# EAGLE schematic Aquila_mobile (EAGLE 6.3)

## Sheet 1 of 5: 0-COVER
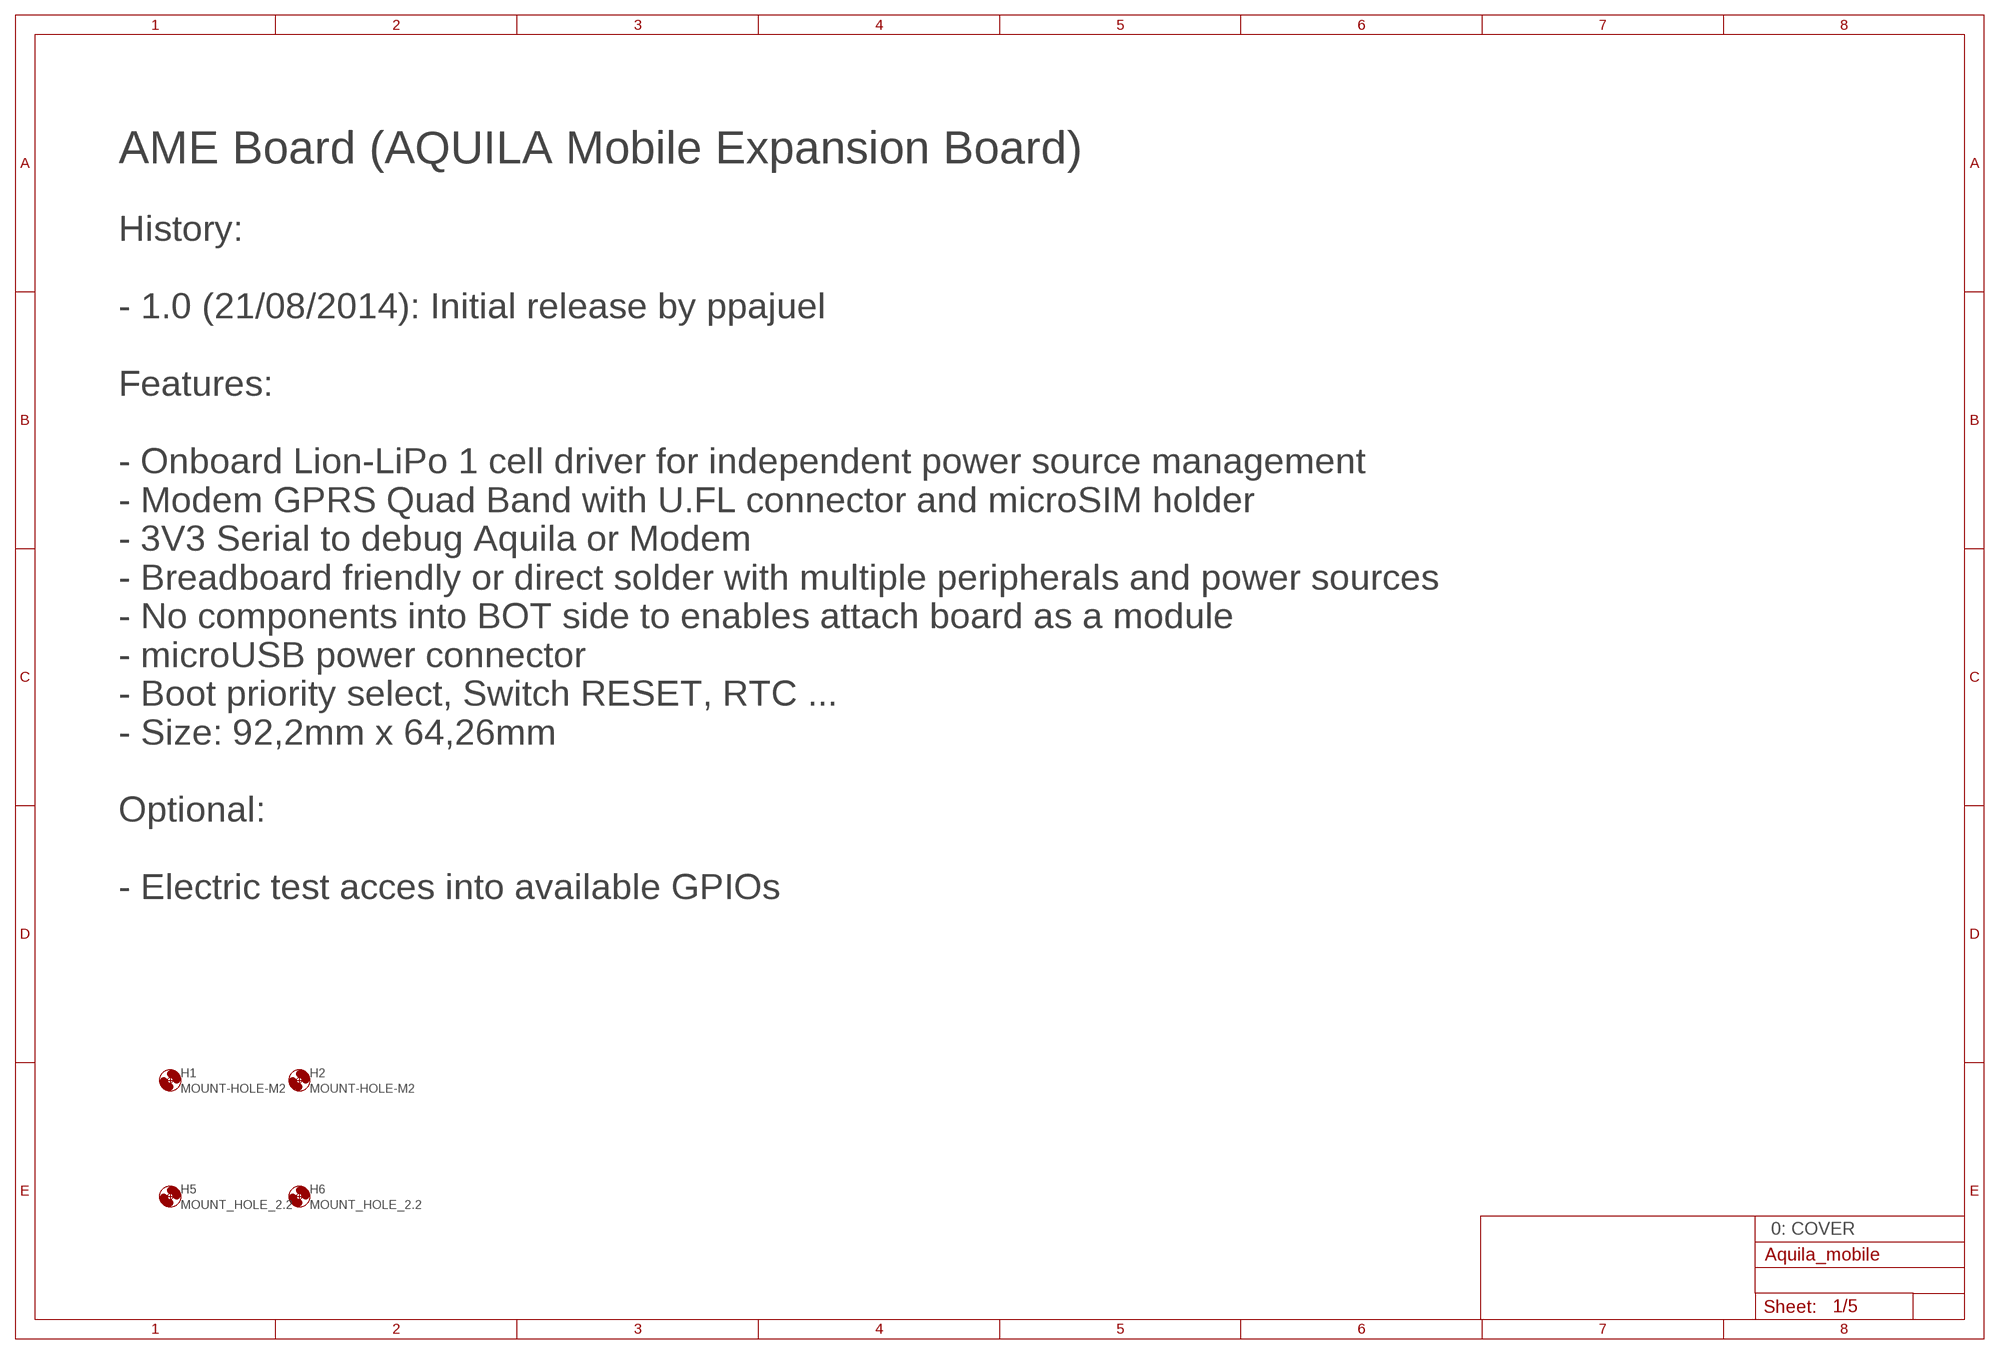
[diagram p0: schematic, sheet 1]

### Parts
H1  MOUNT-HOLE-M2  MOUNT-HOLE5.0  [5,0]
H2  MOUNT-HOLE-M2  MOUNT-HOLE5.0  [5,0]
H5  MOUNT_HOLE_2.2  [HOLE-2.2]
H6  MOUNT_HOLE_2.2  [HOLE-2.2]

### Notes on the sheet
- AME Board (AQUILA Mobile Expansion Board)
- History:
  
  - 1.0 (21/08/2014): Initial release by ppajuel
  
  Features:
  
  - Onboard Lion-LiPo 1 cell driver for independent power source management
  - Modem GPRS Quad Band with U.FL connector and microSIM holder
  - 3V3 Serial to debug Aquila or Modem
  - Breadboard friendly or direct solder with multiple peripherals and power sources
  - No components into BOT side to enables attach board as a module
  - microUSB power connector
  - Boot priority select, Switch RESET, RTC ...
  - Size: 92,2mm x 64,26mm
  
  Optional:
  
  - Electric test acces into available GPIOs
- 0: COVER

## Sheet 2 of 5: 1-SODIMM
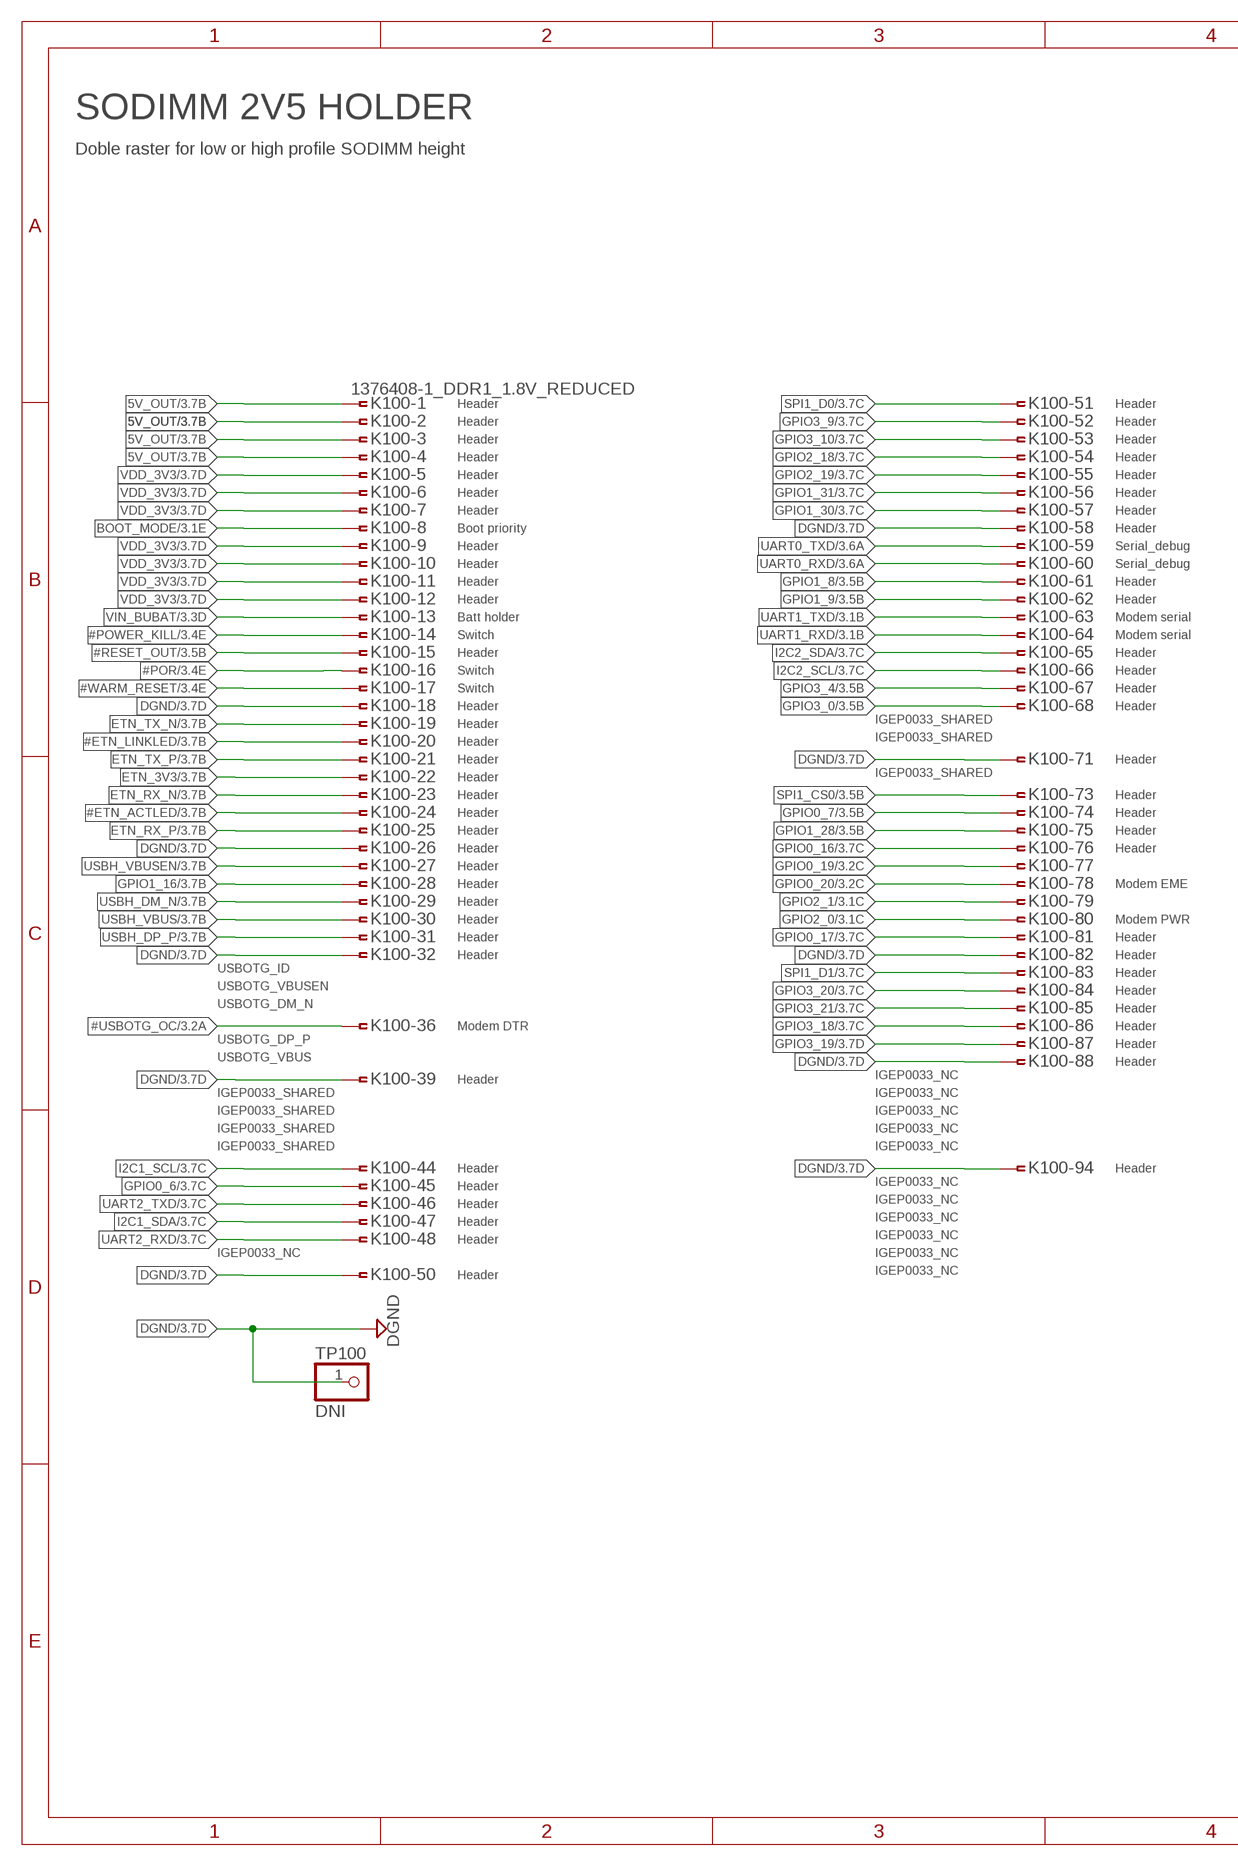
[diagram p1: schematic, sheet 2, part 1 of 2]
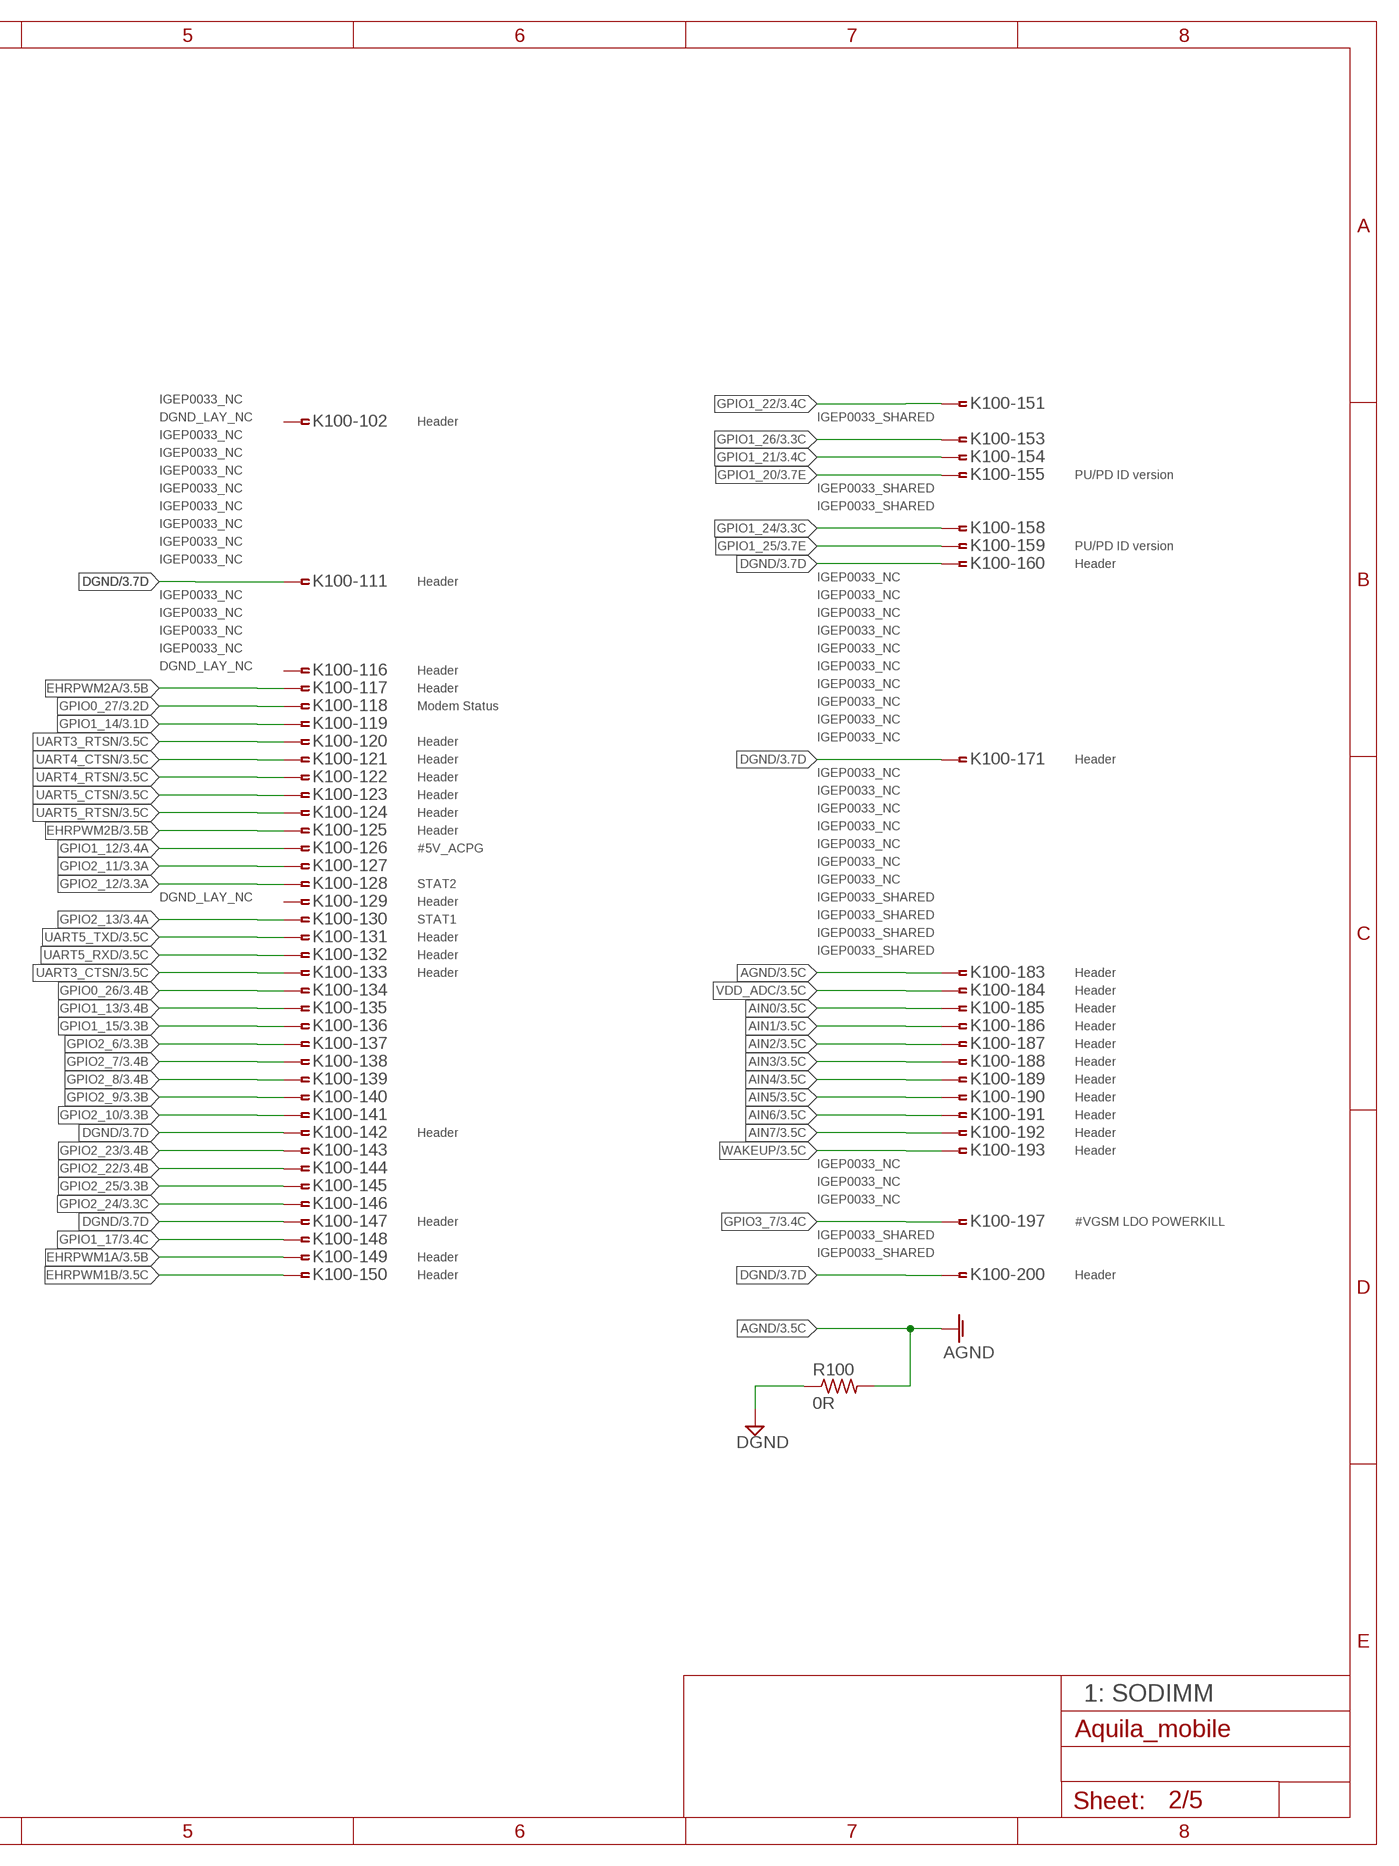
[diagram p2: schematic, sheet 2, part 2 of 2]

### Parts
K100  1376408-1_DDR1_1.8V_REDUCED  [1-1376408-1_REDUCED]
R100  0R  R-US_R0402  [R0402]
TP100  DNI  PINHD-1X1  [1X01]

### Nets
5V_OUT: K100.1 K100.2 K100.3 K100.4 ; also sheet 3,5
#ETN_ACTLED: K100.24 ; also sheet 3
#ETN_LINKLED: K100.20 ; also sheet 3
#POR: K100.16 ; also sheet 3
#POWER_KILL: K100.14 ; also sheet 3
#RESET_OUT: K100.15 ; also sheet 3
#USBOTG_OC: K100.36 ; also sheet 3,4
#WARM_RESET: K100.17 ; also sheet 3
AGND: K100.183 R100.2 ; also sheet 3
AIN0: K100.185 ; also sheet 3
AIN1: K100.186 ; also sheet 3
AIN2: K100.187 ; also sheet 3
AIN3: K100.188 ; also sheet 3
AIN4: K100.189 ; also sheet 3
AIN5: K100.190 ; also sheet 3
AIN6: K100.191 ; also sheet 3
AIN7: K100.192 ; also sheet 3
BOOT_MODE: K100.8 ; also sheet 3
DGND: K100.18 K100.26 K100.32 K100.39 K100.50 K100.58 K100.71 K100.82 K100.88 K100.94 K100.111 K100.142 K100.147 K100.160 K100.171 K100.200 R100.1 TP100.1 ; also sheet 3,4,5
EHRPWM1A: K100.149 ; also sheet 3
EHRPWM1B: K100.150 ; also sheet 3
EHRPWM2A: K100.117 ; also sheet 3
EHRPWM2B: K100.125 ; also sheet 3
ETN_3V3: K100.22 ; also sheet 3
ETN_RX_N: K100.23 ; also sheet 3
ETN_RX_P: K100.25 ; also sheet 3
ETN_TX_N: K100.19 ; also sheet 3
ETN_TX_P: K100.21 ; also sheet 3
GPIO0_6: K100.45 ; also sheet 3
GPIO0_7: K100.74 ; also sheet 3
GPIO0_16: K100.76 ; also sheet 3
GPIO0_17: K100.81 ; also sheet 3
GPIO0_19: K100.77 ; also sheet 3
GPIO0_20: K100.78 ; also sheet 3,4
GPIO0_26: K100.134 ; also sheet 3
GPIO0_27: K100.118 ; also sheet 3,4
GPIO1_8: K100.61 ; also sheet 3
GPIO1_9: K100.62 ; also sheet 3
GPIO1_12: K100.126 ; also sheet 3,5
GPIO1_13: K100.135 ; also sheet 3
GPIO1_14: K100.119 ; also sheet 3
GPIO1_15: K100.136 ; also sheet 3
GPIO1_16: K100.28 ; also sheet 3
GPIO1_17: K100.148 ; also sheet 3
GPIO1_20: K100.155 ; also sheet 3
GPIO1_21: K100.154 ; also sheet 3
GPIO1_22: K100.151 ; also sheet 3
GPIO1_24: K100.158 ; also sheet 3
GPIO1_25: K100.159 ; also sheet 3
GPIO1_26: K100.153 ; also sheet 3
GPIO1_28: K100.75 ; also sheet 3
GPIO1_30: K100.57 ; also sheet 3
GPIO1_31: K100.56 ; also sheet 3
GPIO2_0: K100.80 ; also sheet 3,4
GPIO2_1: K100.79 ; also sheet 3
GPIO2_6: K100.137 ; also sheet 3
GPIO2_7: K100.138 ; also sheet 3
GPIO2_8: K100.139 ; also sheet 3
GPIO2_9: K100.140 ; also sheet 3
GPIO2_10: K100.141 ; also sheet 3
GPIO2_11: K100.127 ; also sheet 3
GPIO2_12: K100.128 ; also sheet 3,5
GPIO2_13: K100.130 ; also sheet 3,5
GPIO2_18: K100.54 ; also sheet 3
GPIO2_19: K100.55 ; also sheet 3
GPIO2_22: K100.144 ; also sheet 3
GPIO2_23: K100.143 ; also sheet 3
GPIO2_24: K100.146 ; also sheet 3
GPIO2_25: K100.145 ; also sheet 3
GPIO3_0: K100.68 ; also sheet 3
GPIO3_4: K100.67 ; also sheet 3
GPIO3_7: K100.197 ; also sheet 3,5
GPIO3_9: K100.52 ; also sheet 3
GPIO3_10: K100.53 ; also sheet 3
GPIO3_18: K100.86 ; also sheet 3
GPIO3_19: K100.87 ; also sheet 3
GPIO3_20: K100.84 ; also sheet 3
GPIO3_21: K100.85 ; also sheet 3
I2C1_SCL: K100.44 ; also sheet 3
I2C1_SDA: K100.47 ; also sheet 3
I2C2_SCL: K100.66 ; also sheet 3
I2C2_SDA: K100.65 ; also sheet 3
SPI1_CS0: K100.73 ; also sheet 3
SPI1_D0: K100.51 ; also sheet 3
SPI1_D1: K100.83 ; also sheet 3
UART0_RXD: K100.60 ; also sheet 3
UART0_TXD: K100.59 ; also sheet 3
UART1_RXD: K100.64 ; also sheet 3,4
UART1_TXD: K100.63 ; also sheet 3,4
UART2_RXD: K100.48 ; also sheet 3
UART2_TXD: K100.46 ; also sheet 3
UART3_CTSN: K100.133 ; also sheet 3
UART3_RTSN: K100.120 ; also sheet 3
UART4_CTSN: K100.121 ; also sheet 3
UART4_RTSN: K100.122 ; also sheet 3
UART5_CTSN: K100.123 ; also sheet 3
UART5_RTSN: K100.124 ; also sheet 3
UART5_RXD: K100.132 ; also sheet 3
UART5_TXD: K100.131 ; also sheet 3
USBH_DM_N: K100.29 ; also sheet 3
USBH_DP_P: K100.31 ; also sheet 3
USBH_VBUS: K100.30 ; also sheet 3
USBH_VBUSEN: K100.27 ; also sheet 3
VDD_3V3: K100.5 K100.6 K100.7 K100.9 K100.10 K100.11 K100.12 ; also sheet 3,5
VDD_ADC: K100.184 ; also sheet 3
VIN_BUBAT: K100.13 ; also sheet 3
WAKEUP: K100.193 ; also sheet 3
Unconnected: K100.102 K100.116 K100.129

### Notes on the sheet
- SODIMM 2V5 HOLDER
- Doble raster for low or high profile SODIMM height
- IGEP0033_NC
- Header | Header
- DGND_LAY_NC | IGEP0033_SHARED
- Header | Header | Header
- IGEP0033_NC
- Header | Header
- IGEP0033_NC
- Header | Header
- IGEP0033_NC
- Header | Header | PU/PD ID version
- IGEP0033_NC | IGEP0033_SHARED
- Header | Header
- IGEP0033_NC | IGEP0033_SHARED
- Header | Header
- IGEP0033_NC
- Boot priority | Header
- IGEP0033_NC
- Header | Serial_debug | PU/PD ID version
- IGEP0033_NC
- Header | Serial_debug | Header
- IGEP0033_NC
- Header | Header | Header
- IGEP0033_NC | IGEP0033_NC
- Header | Header
- IGEP0033_NC | IGEP0033_NC
- Batt holder | Modem serial
- IGEP0033_NC | IGEP0033_NC
- Switch | Modem serial
- IGEP0033_NC | IGEP0033_NC
- Header | Header
- DGND_LAY_NC | IGEP0033_NC
- Switch | Header | Header
- IGEP0033_NC
- Switch | Header | Header
- IGEP0033_NC
- Header | Header | Modem Status
- IGEP0033_SHARED | IGEP0033_NC
- Header
- IGEP0033_SHARED | IGEP0033_NC
- Header | Header
- Header | Header | Header | Header
- IGEP0033_SHARED | IGEP0033_NC
- Header | Header
- IGEP0033_NC
- Header | Header | Header
- IGEP0033_NC
- Header | Header | Header
- IGEP0033_NC
- Header | Header | Header
- IGEP0033_NC
- Header | Header | #5V_ACPG
- IGEP0033_NC
- Header
- IGEP0033_NC
- Header | Modem EME | STAT2
- DGND_LAY_NC | IGEP0033_SHARED
- Header | Header
- IGEP0033_SHARED
- Header | Modem PWR | STAT1
- IGEP0033_SHARED
- Header | Header | Header
- IGEP0033_SHARED
- Header | Header | Header
- USBOTG_ID
- Header | Header | Header
- USBOTG_VBUSEN
- Header | Header
- USBOTG_DM_N
- Header | Header
- Modem DTR | Header | Header
- USBOTG_DP_P
- Header | Header
- USBOTG_VBUS
- Header | Header
- IGEP0033_NC
- Header | Header
- IGEP0033_SHARED | IGEP0033_NC
- Header
- IGEP0033_SHARED | IGEP0033_NC
- Header
- IGEP0033_SHARED | IGEP0033_NC
- Header | Header
- IGEP0033_SHARED | IGEP0033_NC
- Header
- IGEP0033_NC
- Header | Header
- IGEP0033_NC | IGEP0033_NC
- Header
- IGEP0033_NC | IGEP0033_NC
- Header
- IGEP0033_NC
- Header | Header | #VGSM LDO POWERKILL
- IGEP0033_NC | IGEP0033_SHARED
- Header
- IGEP0033_NC | IGEP0033_NC | IGEP0033_SHARED
- Header
- IGEP0033_NC
- Header | Header | Header
- 1: SODIMM

## Sheet 3 of 5: 2-ELECTRIC-TEST
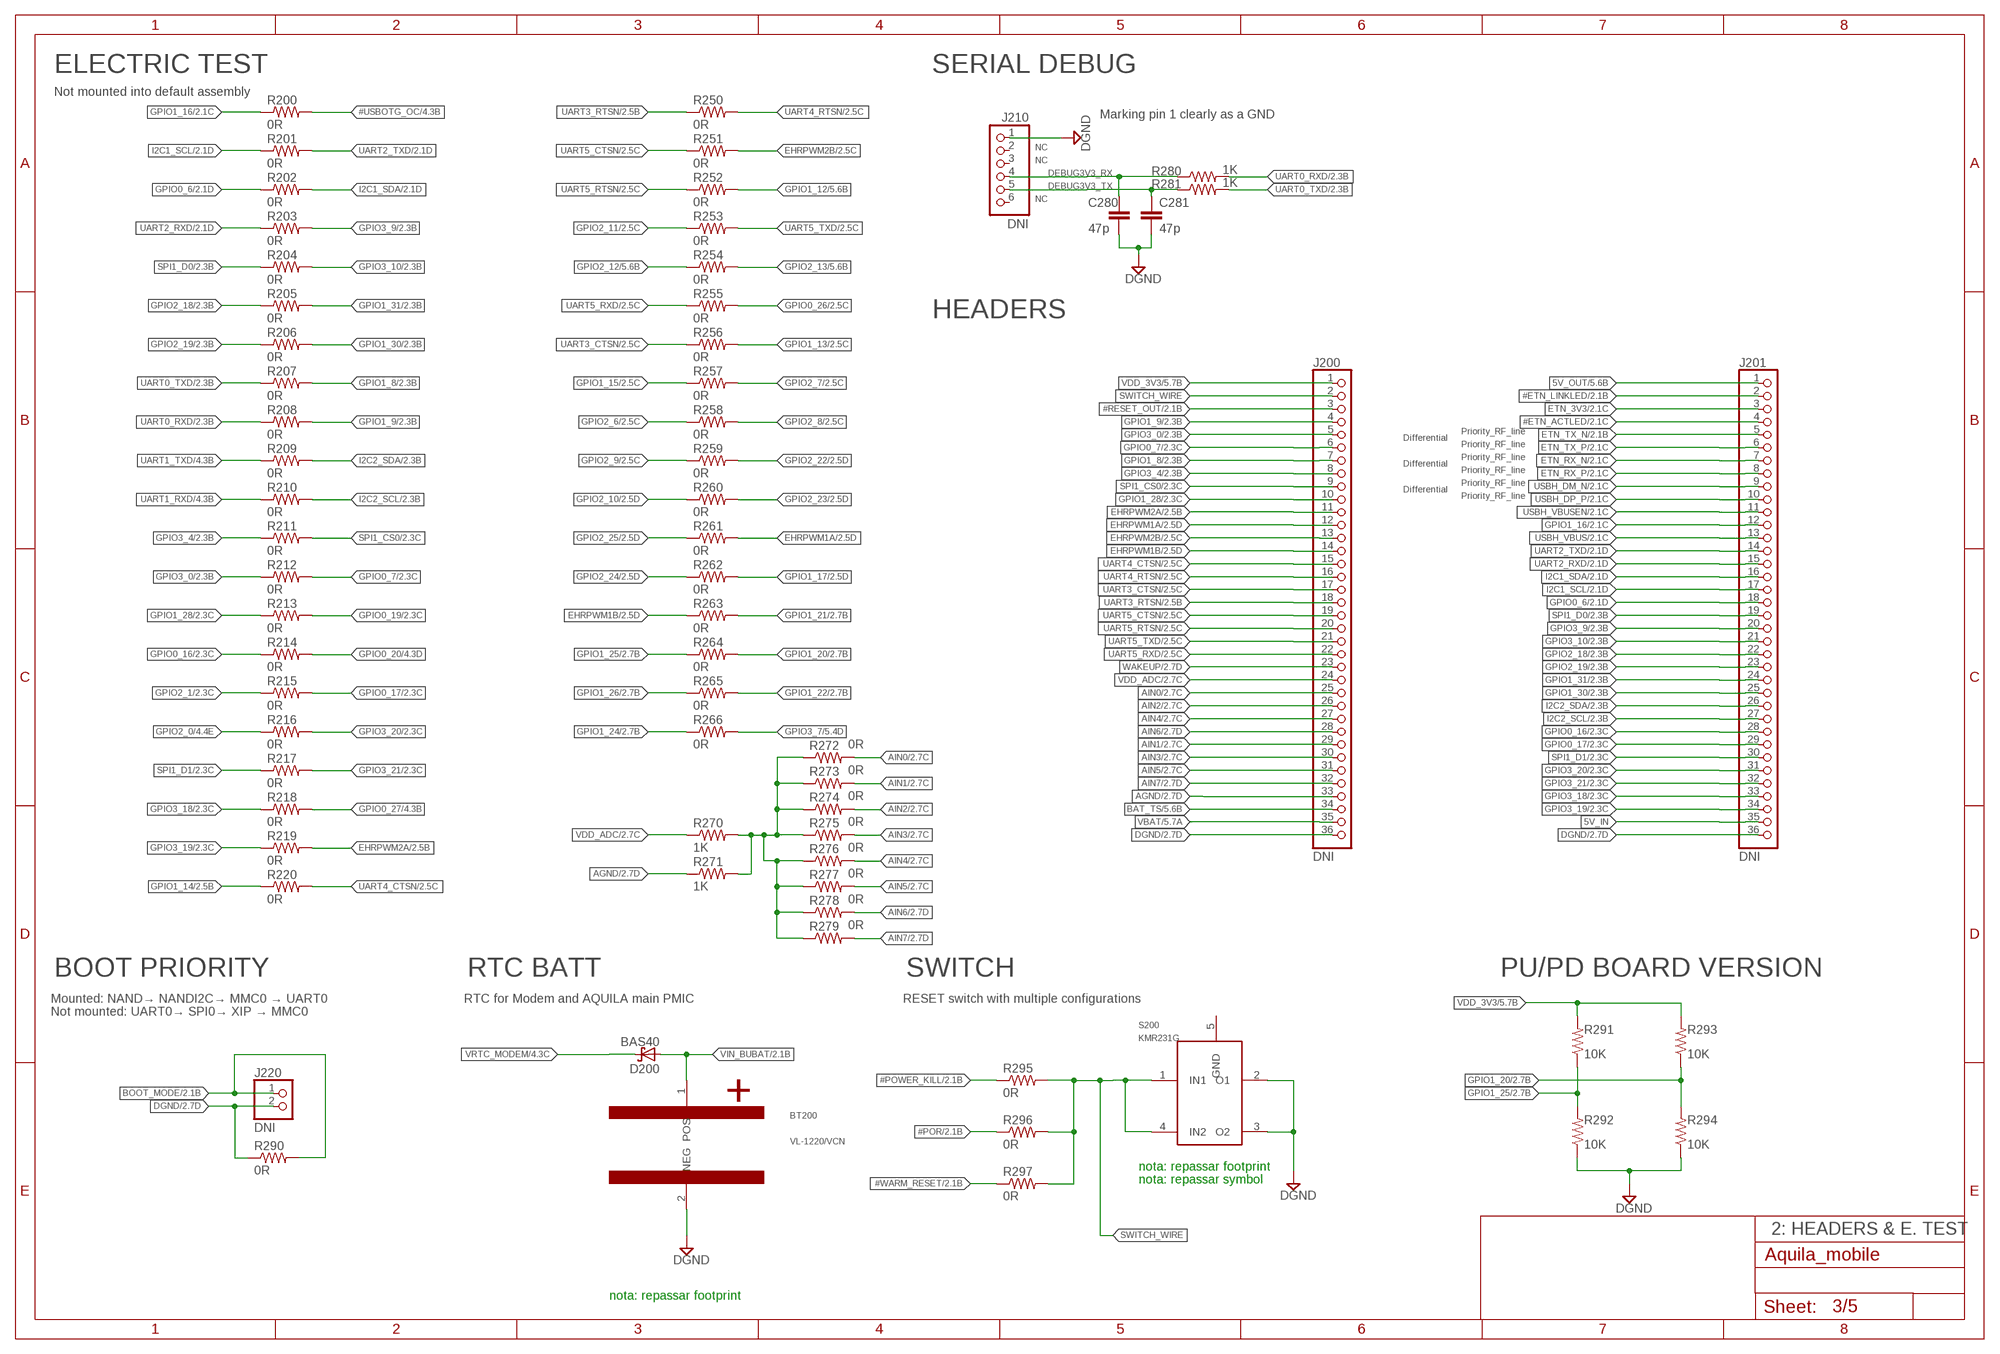
[diagram p3: schematic, sheet 3]

### Parts
BT200  VL-1220/VCN  [VL-1220/VCN]
C280  47p  C-EUC0603  [C0603]
C281  47p  C-EUC0603  [C0603]
D200  BAS40  [SOT23]
J200  DNI  PINHD-1X36  [1X36]
J201  DNI  PINHD-1X36  [1X36]
J210  DNI  PINHD-1X6  [1X06]
J220  DNI  PINHD-1X2  [1X02]
R200  0R  R-US_R0201  [R0201]
R201  0R  R-US_R0201  [R0201]
R202  0R  R-US_R0201  [R0201]
R203  0R  R-US_R0201  [R0201]
R204  0R  R-US_R0201  [R0201]
R205  0R  R-US_R0201  [R0201]
R206  0R  R-US_R0201  [R0201]
R207  0R  R-US_R0201  [R0201]
R208  0R  R-US_R0201  [R0201]
R209  0R  R-US_R0201  [R0201]
R210  0R  R-US_R0201  [R0201]
R211  0R  R-US_R0201  [R0201]
R212  0R  R-US_R0201  [R0201]
R213  0R  R-US_R0201  [R0201]
R214  0R  R-US_R0201  [R0201]
R215  0R  R-US_R0201  [R0201]
R216  0R  R-US_R0201  [R0201]
R217  0R  R-US_R0201  [R0201]
R218  0R  R-US_R0201  [R0201]
R219  0R  R-US_R0201  [R0201]
R220  0R  R-US_R0201  [R0201]
R250  0R  R-US_R0201  [R0201]
R251  0R  R-US_R0201  [R0201]
R252  0R  R-US_R0201  [R0201]
R253  0R  R-US_R0201  [R0201]
R254  0R  R-US_R0201  [R0201]
R255  0R  R-US_R0201  [R0201]
R256  0R  R-US_R0201  [R0201]
R257  0R  R-US_R0201  [R0201]
R258  0R  R-US_R0201  [R0201]
R259  0R  R-US_R0201  [R0201]
R260  0R  R-US_R0201  [R0201]
R261  0R  R-US_R0402  [R0402]
R262  0R  R-US_R0201  [R0201]
R263  0R  R-US_R0201  [R0201]
R264  0R  R-US_R0201  [R0201]
R265  0R  R-US_R0201  [R0201]
R266  0R  R-US_R0201  [R0201]
R270  1K  R-US_R0402  [R0402]
R271  1K  R-US_R0402  [R0402]
R272  0R  R-US_R0201  [R0201]
R273  0R  R-US_R0201  [R0201]
R274  0R  R-US_R0201  [R0201]
R275  0R  R-US_R0201  [R0201]
R276  0R  R-US_R0201  [R0201]
R277  0R  R-US_R0201  [R0201]
R278  0R  R-US_R0201  [R0201]
R279  0R  R-US_R0201  [R0201]
R280  1K  R-US_R0603  [R0603]
R281  1K  R-US_R0603  [R0603]
R290  0R  R-US_R0402  [R0402]
R291  10K  R-US_R0402  [R0402]
R292  10K  R-US_R0402  [R0402]
R293  10K  R-US_R0402  [R0402]
R294  10K  R-US_R0402  [R0402]
R295  0R  R-US_R0201  [R0201]
R296  0R  R-US_R0201  [R0201]
R297  0R  R-US_R0201  [R0201]
S200  KMR231G  [KMR231G]

### Nets
5V_IN: J201.35 ; also sheet 5
5V_OUT: J201.1 ; also sheet 2,5
#ETN_ACTLED: J201.4 ; also sheet 2
#ETN_LINKLED: J201.2 ; also sheet 2
#POR: R296.1 ; also sheet 2
#POWER_KILL: R295.1 ; also sheet 2
#RESET_OUT: J200.3 ; also sheet 2
#USBOTG_OC: R200.2 ; also sheet 2,4
#WARM_RESET: R297.1 ; also sheet 2
ADCREFERENCE: R270.2 R271.2 R272.1 R273.1 R274.1 R275.1 R276.1 R277.1 R278.1 R279.1
AGND: J200.33 R271.1 ; also sheet 2
AIN0: J200.25 R272.2 ; also sheet 2
AIN1: J200.29 R273.2 ; also sheet 2
AIN2: J200.26 R274.2 ; also sheet 2
AIN3: J200.30 R275.2 ; also sheet 2
AIN4: J200.27 R276.2 ; also sheet 2
AIN5: J200.31 R277.2 ; also sheet 2
AIN6: J200.28 R278.2 ; also sheet 2
AIN7: J200.32 R279.2 ; also sheet 2
BAT_TS: J200.34 ; also sheet 5
BOOT_MODE: J220.1 R290.2 ; also sheet 2
DEBUG3V3_RX: C280.1 J210.4 R280.1 ; also sheet 4
DEBUG3V3_TX: C281.1 J210.5 R281.1 ; also sheet 4
DGND: BT200.2(NEG) C280.2 C281.2 J200.36 J201.36 J210.1 J220.2 R290.1 R292.1 R294.1 S200.2(O1) S200.3(O2) ; also sheet 2,4,5
EHRPWM1A: J200.12 R261.2 ; also sheet 2
EHRPWM1B: J200.14 R263.1 ; also sheet 2
EHRPWM2A: J200.11 R219.2 ; also sheet 2
EHRPWM2B: J200.13 R251.2 ; also sheet 2
ETN_3V3: J201.3 ; also sheet 2
ETN_RX_N: J201.7 ; also sheet 2
ETN_RX_P: J201.8 ; also sheet 2
ETN_TX_N: J201.5 ; also sheet 2
ETN_TX_P: J201.6 ; also sheet 2
GPIO0_6: J201.18 R202.1 ; also sheet 2
GPIO0_7: J200.6 R212.2 ; also sheet 2
GPIO0_16: J201.28 R214.1 ; also sheet 2
GPIO0_17: J201.29 R215.2 ; also sheet 2
GPIO0_19: R213.2 ; also sheet 2
GPIO0_20: R214.2 ; also sheet 2,4
GPIO0_26: R255.2 ; also sheet 2
GPIO0_27: R218.2 ; also sheet 2,4
GPIO1_8: J200.7 R207.2 ; also sheet 2
GPIO1_9: J200.4 R208.2 ; also sheet 2
GPIO1_12: R252.2 ; also sheet 2,5
GPIO1_13: R256.2 ; also sheet 2
GPIO1_14: R220.1 ; also sheet 2
GPIO1_15: R257.1 ; also sheet 2
GPIO1_16: J201.12 R200.1 ; also sheet 2
GPIO1_17: R262.2 ; also sheet 2
GPIO1_20: R264.2 R293.1 R294.2 ; also sheet 2
GPIO1_21: R263.2 ; also sheet 2
GPIO1_22: R265.2 ; also sheet 2
GPIO1_24: R266.1 ; also sheet 2
GPIO1_25: R264.1 R291.1 R292.2 ; also sheet 2
GPIO1_26: R265.1 ; also sheet 2
GPIO1_28: J200.10 R213.1 ; also sheet 2
GPIO1_30: J201.25 R206.2 ; also sheet 2
GPIO1_31: J201.24 R205.2 ; also sheet 2
GPIO2_0: R216.1 ; also sheet 2,4
GPIO2_1: R215.1 ; also sheet 2
GPIO2_6: R258.1 ; also sheet 2
GPIO2_7: R257.2 ; also sheet 2
GPIO2_8: R258.2 ; also sheet 2
GPIO2_9: R259.1 ; also sheet 2
GPIO2_10: R260.1 ; also sheet 2
GPIO2_11: R253.1 ; also sheet 2
GPIO2_12: R254.1 ; also sheet 2,5
GPIO2_13: R254.2 ; also sheet 2,5
GPIO2_18: J201.22 R205.1 ; also sheet 2
GPIO2_19: J201.23 R206.1 ; also sheet 2
GPIO2_22: R259.2 ; also sheet 2
GPIO2_23: R260.2 ; also sheet 2
GPIO2_24: R262.1 ; also sheet 2
GPIO2_25: R261.1 ; also sheet 2
GPIO3_0: J200.5 R212.1 ; also sheet 2
GPIO3_4: J200.8 R211.1 ; also sheet 2
GPIO3_7: R266.2 ; also sheet 2,5
GPIO3_9: J201.20 R203.2 ; also sheet 2
GPIO3_10: J201.21 R204.2 ; also sheet 2
GPIO3_18: J201.33 R218.1 ; also sheet 2
GPIO3_19: J201.34 R219.1 ; also sheet 2
GPIO3_20: J201.31 R216.2 ; also sheet 2
GPIO3_21: J201.32 R217.2 ; also sheet 2
I2C1_SCL: J201.17 R201.1 ; also sheet 2
I2C1_SDA: J201.16 R202.2 ; also sheet 2
I2C2_SCL: J201.27 R210.2 ; also sheet 2
I2C2_SDA: J201.26 R209.2 ; also sheet 2
SPI1_CS0: J200.9 R211.2 ; also sheet 2
SPI1_D0: J201.19 R204.1 ; also sheet 2
SPI1_D1: J201.30 R217.1 ; also sheet 2
SWITCH_WIRE: J200.2 R295.2 R296.2 R297.2 S200.1(IN1) S200.4(IN2)
UART0_RXD: R208.1 R280.2 ; also sheet 2
UART0_TXD: R207.1 R281.2 ; also sheet 2
UART1_RXD: R210.1 ; also sheet 2,4
UART1_TXD: R209.1 ; also sheet 2,4
UART2_RXD: J201.15 R203.1 ; also sheet 2
UART2_TXD: J201.14 R201.2 ; also sheet 2
UART3_CTSN: J200.17 R256.1 ; also sheet 2
UART3_RTSN: J200.18 R250.1 ; also sheet 2
UART4_CTSN: J200.15 R220.2 ; also sheet 2
UART4_RTSN: J200.16 R250.2 ; also sheet 2
UART5_CTSN: J200.19 R251.1 ; also sheet 2
UART5_RTSN: J200.20 R252.1 ; also sheet 2
UART5_RXD: J200.22 R255.1 ; also sheet 2
UART5_TXD: J200.21 R253.2 ; also sheet 2
USBH_DM_N: J201.9 ; also sheet 2
USBH_DP_P: J201.10 ; also sheet 2
USBH_VBUS: J201.13 ; also sheet 2
USBH_VBUSEN: J201.11 ; also sheet 2
VBAT: J200.35 ; also sheet 5
VDD_3V3: J200.1 R291.2 R293.2 ; also sheet 2,5
VDD_ADC: J200.24 R270.1 ; also sheet 2
VIN_BUBAT: BT200.1(POS) D200.1(A) ; also sheet 2
VRTC_MODEM: D200.3(C) ; also sheet 4
WAKEUP: J200.23 ; also sheet 2
Unconnected: J210.2 J210.3 J210.6 S200.5(GND)

### Notes on the sheet
- ELECTRIC TEST | SERIAL DEBUG
- Not mounted into default assembly
- Marking pin 1 clearly as a GND
- NC
- NC
- NC
- HEADERS
- Priority_RF_line
- Differential
- Priority_RF_line
- Priority_RF_line
- Differential
- Priority_RF_line
- Priority_RF_line
- Differential
- Priority_RF_line
- BOOT PRIORITY | RTC BATT | SWITCH | PU/PD BOARD VERSION
- Mounted: NAND→ NANDI2C→ MMC0 → UART0 | RTC for Modem and AQUILA main PMIC | RESET switch with multiple configurations
- Not mounted: UART0→ SPI0→ XIP → MMC0
- nota: repassar footprint
- nota: repassar symbol
- 2: HEADERS & E. TEST
- nota: repassar footprint

## Sheet 4 of 5: 3-MODEM
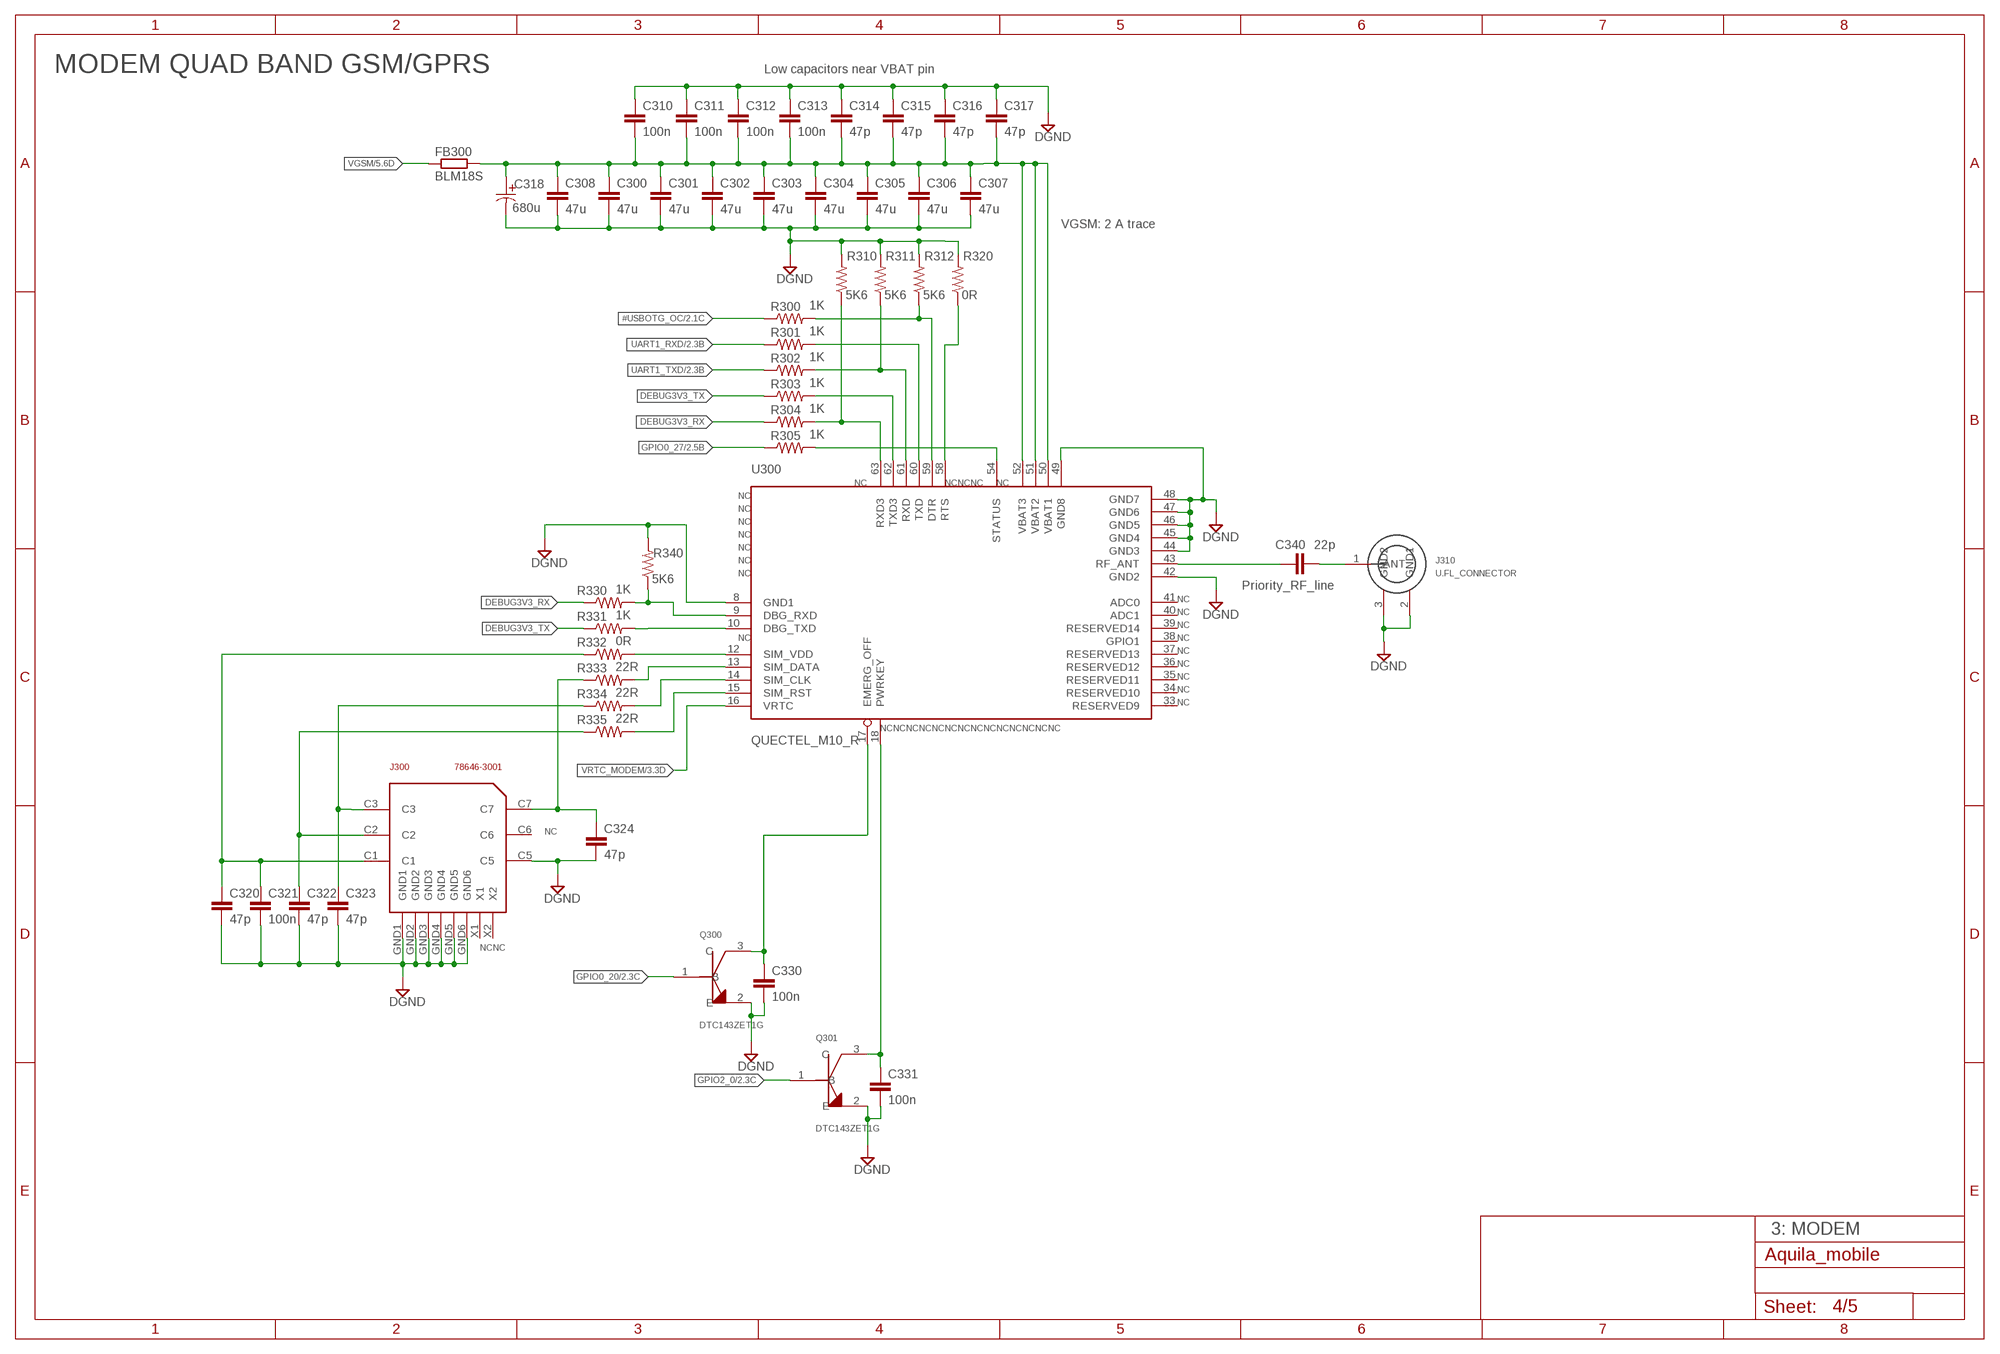
[diagram p4: schematic, sheet 4]

### Parts
C300  47u  C-EUC0805  [C0805]
C301  47u  C-EUC0805  [C0805]
C302  47u  C-EUC0805  [C0805]
C303  47u  C-EUC0805  [C0805]
C304  47u  C-EUC0805  [C0805]
C305  47u  C-EUC0805  [C0805]
C306  47u  C-EUC0805  [C0805]
C307  47u  C-EUC0805  [C0805]
C308  47u  C-EUC0805  [C0805]
C310  100n  C-EUC0603  [C0603]
C311  100n  C-EUC0603  [C0603]
C312  100n  C-EUC0603  [C0603]
C313  100n  C-EUC0603  [C0603]
C314  47p  C-EUC0603  [C0603]
C315  47p  C-EUC0603  [C0603]
C316  47p  C-EUC0603  [C0603]
C317  47p  C-EUC0603  [C0603]
C318  680u  EEE-FTJ681XAP-CASE-D8  [CAPAE660X800N]
C320  47p  C-EUC0603  [C0603]
C321  100n  C-EUC0603  [C0603]
C322  47p  C-EUC0603  [C0603]
C323  47p  C-EUC0603  [C0603]
C324  47p  C-EUC0603  [C0603]
C330  100n  C-EUC0603  [C0603]
C331  100n  C-EUC0603  [C0603]
C340  22p  C-EUC0402K  [C0402K]
FB300  BLM18S  R-EU_R0603  [R0603]
J300  78646-3001  [78646-3001]
J310  U.FL_CONNECTOR  [U.FL_RECEPTACLE]
Q300  DTC143ZET1G  [SOT-416]
Q301  DTC143ZET1G  [SOT-416]
R300  1K  R-US_R0603  [R0603]
R301  1K  R-US_R0603  [R0603]
R302  1K  R-US_R0603  [R0603]
R303  1K  R-US_R0603  [R0603]
R304  1K  R-US_R0603  [R0603]
R305  1K  R-US_R0603  [R0603]
R310  5K6  R-US_R0603  [R0603]
R311  5K6  R-US_R0603  [R0603]
R312  5K6  R-US_R0603  [R0603]
R320  0R  R-US_R0603  [R0603]
R330  1K  R-US_R0603  [R0603]
R331  1K  R-US_R0603  [R0603]
R332  0R  R-US_R0603  [R0603]
R333  22R  R-US_R0603  [R0603]
R334  22R  R-US_R0603  [R0603]
R335  22R  R-US_R0603  [R0603]
R340  5K6  R-US_R0603  [R0603]
U300  QUECTEL_M10_R  QUECTEL_M10  [QUECTEL_M10]

### Nets
#USBOTG_OC: R300.1 ; also sheet 2,3
C400: C340.1 U300.43(RF_ANT)
DEBUG3V3_RX: R304.1 R330.1 ; also sheet 3
DEBUG3V3_TX: R303.1 R331.1 ; also sheet 3
DGND: C300.2 C301.2 C302.2 C303.2 C304.2 C305.2 C306.2 C307.2 C308.2 C310.1 C311.1 C312.1 C313.1 C314.1 C315.1 C316.1 C317.1 C318.2 C320.2 C321.2 C322.2 C323.2 C324.2 C330.2 C331.2 J300.C5 J300.GND1 J300.GND2 J300.GND3 J300.GND4 J300.GND5 J300.GND6 J310.2(GND1) J310.3(GND2) Q300.2(E) Q301.2(E) R310.2 R311.2 R312.2 R320.2 R340.2 U300.8(GND1) U300.42(GND2) U300.44(GND3) U300.45(GND4) U300.46(GND5) U300.47(GND6) U300.48(GND7) U300.49(GND8) ; also sheet 2,3,5
GPIO0_20: Q300.1(B) ; also sheet 2,3
GPIO0_27: R305.1 ; also sheet 2,3
GPIO2_0: Q301.1(B) ; also sheet 2,3
N$1: R305.2 U300.54(STATUS)
N$2: C340.2 J310.1(ANT)
N$3: C300.1 C301.1 C302.1 C303.1 C304.1 C305.1 C306.1 C307.1 C308.1 C310.2 C311.2 C312.2 C313.2 C314.2 C315.2 C316.2 C317.2 C318.1 FB300.2 U300.50(VBAT1) U300.51(VBAT2) U300.52(VBAT3)
N$5: R301.2 U300.60(TXD)
N$17: R302.2 R311.1 U300.61(RXD)
N$20: R303.2 U300.62(TXD3)
N$25: R320.1 U300.58(RTS)
N$26: R304.2 R310.1 U300.63(RXD3)
N$27: R332.2 U300.12(SIM_VDD)
N$28: R333.2 U300.13(SIM_DATA)
N$29: R330.2 R340.1 U300.9(DBG_RXD)
N$30: R331.2 U300.10(DBG_TXD)
N$31: R334.2 U300.14(SIM_CLK)
N$32: R335.2 U300.15(SIM_RST)
N$33: C320.1 C321.1 J300.C1 R332.1
N$34: C324.1 J300.C7 R333.1
N$35: C330.1 Q300.3(C) U300.17(EMERG_OFF)
N$36: C322.1 J300.C2 R335.1
N$39: C323.1 J300.C3 R334.1
N$41: C331.1 Q301.3(C) U300.18(PWRKEY)
N$42: R300.2 R312.1 U300.59(DTR)
UART1_RXD: R301.1 ; also sheet 2,3
UART1_TXD: R302.1 ; also sheet 2,3
VGSM: FB300.1 ; also sheet 5
VRTC_MODEM: U300.16(VRTC) ; also sheet 3
Unconnected: J300.C6 J300.X1 J300.X2 U300.33(RESERVED9) U300.34(RESERVED10) U300.35(RESERVED11) U300.36(RESERVED12) U300.37(RESERVED13) U300.38(GPIO1) U300.39(RESERVED14) U300.40(ADC1) U300.41(ADC0)

### Notes on the sheet
- MODEM QUAD BAND GSM/GPRS | Low capacitors near VBAT pin
- VGSM: 2 A trace
- NC | NC | NC | NC | NC
- NC
- NC
- NC
- NC
- NC
- NC
- NC
- Priority_RF_line
- NC
- NC
- NC
- NC | NC
- NC
- NC
- NC
- NC
- NC
- NC | NC | NC | NC | NC | NC | NC | NC | NC | NC | NC | NC | NC | NC
- NC
- NC | NC
- 3: MODEM

## Sheet 5 of 5: 4- POWER
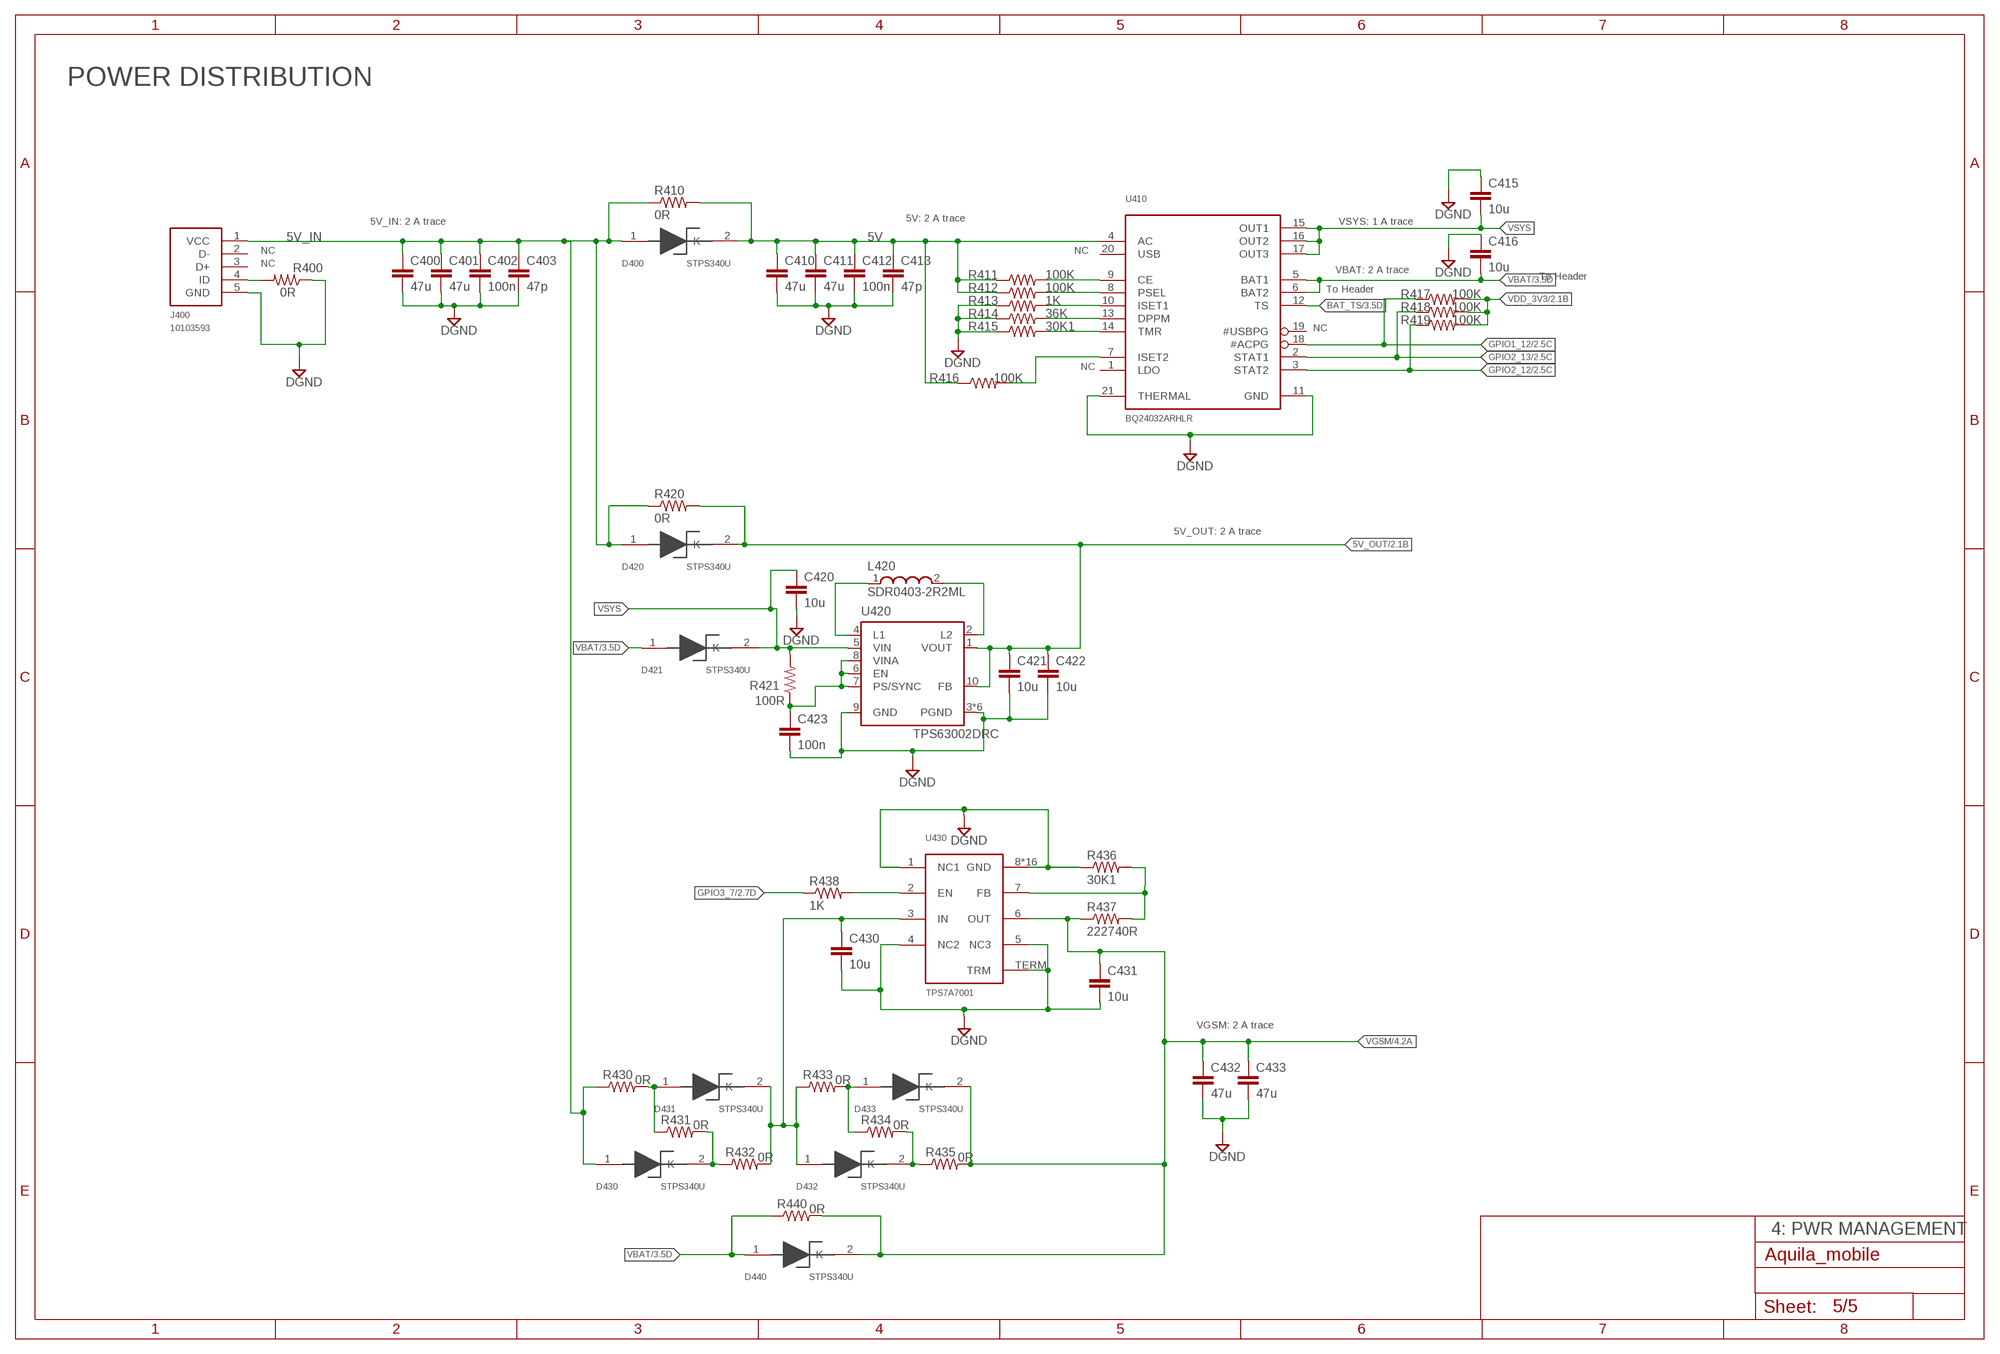
[diagram p5: schematic, sheet 5]

### Parts
C400  47u  C-EUC0805  [C0805]
C401  47u  C-EUC0805  [C0805]
C402  100n  C-EUC0603  [C0603]
C403  47p  C-EUC0603  [C0603]
C410  47u  C-EUC0805  [C0805]
C411  47u  C-EUC0805  [C0805]
C412  100n  C-EUC0603  [C0603]
C413  47p  C-EUC0603  [C0603]
C415  10u  C-EUC0603  [C0603]
C416  10u  C-EUC0603  [C0603]
C420  10u  C-EUC0603  [C0603]
C421  10u  C-EUC0603  [C0603]
C422  10u  C-EUC0603  [C0603]
C423  100n  C-EUC0603  [C0603]
C430  10u  C-EUC0603  [C0603]
C431  10u  C-EUC0603  [C0603]
C432  47u  C-EUC0805  [C0805]
C433  47u  C-EUC0805  [C0805]
D400  STPS340U  [SMB]
D420  STPS340U  [SMB]
D421  STPS340U  [SMB]
D430  STPS340U  [SMB]
D431  STPS340U  [SMB]
D432  STPS340U  [SMB]
D433  STPS340U  [SMB]
D440  STPS340U  [SMB]
J400  10103593  [10103593-0001LF]
L420  SDR0403-2R2ML  SDR0403  [SDR0403]
R400  0R  R-US_R0402  [R0402]
R410  0R  R-US_R0402  [R0402]
R411  100K  R-US_R0603  [R0603]
R412  100K  R-US_R0603  [R0603]
R413  1K  R-US_R0603  [R0603]
R414  36K  R-US_R0603  [R0603]
R415  30K1  R-US_R0603  [R0603]
R416  100K  R-US_R0603  [R0603]
R417  100K  R-US_R0603  [R0603]
R418  100K  R-US_R0603  [R0603]
R419  100K  R-US_R0603  [R0603]
R420  0R  R-US_R0402  [R0402]
R421  100R  R-US_R0603  [R0603]
R430  0R  R-US_R0402  [R0402]
R431  0R  R-US_R0402  [R0402]
R432  0R  R-US_R0402  [R0402]
R433  0R  R-US_R0402  [R0402]
R434  0R  R-US_R0402  [R0402]
R435  0R  R-US_R0402  [R0402]
R436  30K1  R-US_R0603  [R0603]
R437  222740R  R-US_R0603  [R0603]
R438  1K  R-US_R0603  [R0603]
R440  0R  R-US_R0402  [R0402]
U410  BQ24032ARHLR  [BQ24032ARHLR]
U420  TPS63002DRC  TPS6300  [DRC-S-PVSON-N10]
U430  TPS7A7001  [8SO_POWERPAD]

### Nets
5V: C410.1 C411.1 C412.1 C413.1 D400.2(K) R410.2 R411.1 R412.1 R416.1 U410.4(AC)
5V_IN: C400.1 C401.1 C402.1 C403.1 D400.1(A) D420.1(A) D430.1(A) J400.1(VCC) R410.1 R420.1 R430.1 ; also sheet 3
5V_OUT: C421.1 C422.1 D420.2(K) R420.2 U420.1(VOUT) U420.10(FB) ; also sheet 2,3
BAT_TS: U410.12(TS) ; also sheet 3
DGND: C400.2 C401.2 C402.2 C403.2 C410.2 C411.2 C412.2 C413.2 C415.1 C416.1 C420.2 C421.2 C422.2 C423.2 C430.2 C431.2 C432.2 C433.2 J400.5(GND) R400.1 R413.1 R414.1 R415.1 R436.1 U410.11(GND) U410.21(THERMAL) U420.3(PGND) U420.9(GND) U420.EXP@1(PGND) U420.EXP@2(PGND) U420.EXP@3(PGND) U420.EXP@4(PGND) U420.TH(PGND) U430.1(NC1) U430.4(NC2) U430.5(NC3) U430.8(GND) U430.EXP@1(GND) U430.EXP@2(GND) U430.EXP@6(GND) U430.EXP@7(GND) U430.EXP@8(GND) U430.EXP@9(GND) U430.EXP@10(GND) U430.EXP@11(GND) U430.EXP@14(GND) U430.EXP@15(GND) U430.EXP@16(GND) U430.EXP@17(GND) U430.EXP@18(GND) U430.EXP@24(GND) U430.EXP@25(GND) U430.TERM(TRM) ; also sheet 2,3,4
GPIO1_12: R417.1 U410.18(#ACPG) ; also sheet 2,3
GPIO2_12: R419.1 U410.3(STAT2) ; also sheet 2,3
GPIO2_13: R418.1 U410.2(STAT1) ; also sheet 2,3
GPIO3_7: R438.1 ; also sheet 2,3
N$4: D431.1(A) R430.2 R431.1
N$6: R411.2 U410.9(CE)
N$7: J400.4(ID) R400.2
N$8: R412.2 U410.8(PSEL)
N$9: R413.2 U410.10(ISET1)
N$10: R414.2 U410.13(DPPM)
N$11: R415.2 U410.14(TMR)
N$12: R416.2 U410.7(ISET2)
N$13: L420.1 U420.4(L1)
N$14: L420.2 U420.2(L2)
N$15: D430.2(K) R431.2 R432.1
N$16: C423.1 R421.1 U420.6(EN) U420.7(PS/SYNC) U420.8(VINA)
N$18: D433.1(A) R433.2 R434.1
N$19: D432.2(K) R434.2 R435.1
N$21: R436.2 R437.2 U430.7(FB)
N$22: C430.1 D431.2(K) D432.1(A) R432.2 R433.1 U430.3(IN)
N$98: R438.2 U430.2(EN)
VBAT: C416.2 D421.1(A) D440.1(A) R440.1 U410.5(BAT1) U410.6(BAT2) ; also sheet 3
VDD_3V3: R417.2 R418.2 R419.2 ; also sheet 2,3
VGSM: C431.1 C432.1 C433.1 D433.2(K) D440.2(K) R435.2 R437.1 R440.2 U430.6(OUT) ; also sheet 4
VSYS: C415.2 C420.1 D421.2(K) R421.2 U410.15(OUT1) U410.16(OUT2) U410.17(OUT3) U420.5(VIN)
Unconnected: J400.2(D-) J400.3(D+) U410.1(LDO) U410.19(#USBPG) U410.20(USB)

### Notes on the sheet
- POWER DISTRIBUTION
- 5V: 2 A trace
- 5V_IN: 2 A trace | VSYS: 1 A trace
- NC | NC
- NC
- VBAT: 2 A trace
- To Header
- To Header
- NC
- NC
- 5V_OUT: 2 A trace
- VGSM: 2 A trace
- 4: PWR MANAGEMENT

## Library data of the parts
BT200 = ppajuel_library:VL-1220/VCN: BATTERY LITH COIN 3V 12.5MM VERT
C280 C281 C300-C308 C310-C317 C320-C324 C330 C331 C340 C400-C403 C410-C413 C415 C416 C420-C423 C430-C433 = rcl:C-EU: CAPACITOR, European symbol
C318 = Panasonic-EEEFT_EEEH:EEE-: Aluminum Electrolytic Capacitors,Surface Mount Type; MPN: EEE-FTJ681XAP; OC_FARNELL: 2065956; OC_NEWARK: 73T9145; PACKAGE: CASE-D8; SUPPLIER: PANASONIC; TOLERANCE: ±20 %; VALUE: 680UF; VOLTAGERATING: 6.3V
D200 = diode:BAS40: Silicon Schottky Diodes General-purpose diode for high-speed switching
D400 D420 D421 D430-D433 D440 = ppajuel_library:STPS340U: DIODE SCHOTTKY 40V 3A SMB
FB300 = rcl:R-EU_: RESISTOR, European symbol
H1 H2 = holes-MOD:MOUNT-HOLE: MOUNTING HOLE with drill center marker
H5 H6 = holes-MOD:MOUNT_HOLE_2.2
J200 J201 = pinhead-MOD:PINHD-1X36: PIN HEADER
J210 = adafruit:PINHD-1X6: PIN HEADER
J220 = pinhead-MOD:PINHD-1X2: PIN HEADER
J300 = ppajuel_library:78646-3001: 1.45mm Height Push-Pull micro-SIM Card Socket without Detect Switch, Surface Mount, 6 Circuits, Halogen-Free, Lead-Free
J310 = ppajuel_library:U.FL_CONNECTOR: HIROSE U.FL connector
J400 = ppajuel_library:10103593: 10103594-0001LF - MICRO USB : B TYPE POWER RECEPTACLE
K100 = con-amp-MOD:1376408: DDR1 & DDR2 SODIMM SOCKET 0.6mm Pitch 200 Pos. Standard Profile, Standard Type (used on Kontron X-Board) Source: http://catalog.tycoelectronics.com .. JPN_CD_1376408_S.pdf
L420 = ppajuel_library:SDR0403: BOURNS - SDR0403 series
Q300 Q301 = ppajuel_library:DTC143ZET1G: Conmutación de transistores - polarizados por resistencias 100mA 50V BRT NPN
R100 R200-R220 R250-R266 R270-R281 R290-R297 R300-R305 R310-R312 R320 R330-R335 R340 R400 R410-R421 R430-R438 R440 = rcl:R-US_: RESISTOR, American symbol
S200 = ppajuel_library:KMR231G: SWITCH, SMD, 3N, SPST, 0.05A, 32VDC
TP100 = pinhead-MOD:PINHD-1X1: PIN HEADER
U300 = ppajuel_library:QUECTEL_M10: QUECTEL M10 Quad-band GSM/GPRS
U410 = ppajuel_library:BQ24032ARHLR: BQ24032ARHLR
U420 = texas-MOD:TPS6300*: HIGH EFFICIENT SINGLE INDUCTOR BUCK-BOOST CONVERTER WITH 1.8-A SWITCHES Source: http://focus.ti.com/lit/ds/symlink/tps63001.pdf; MPN: TPS63000DRCTG4; OC_FARNELL: 1511852; OC_NEWARK: 59M7217
U430 = ppajuel_library:TPS7A7001: 2A, Single Output, Very Low Input, Adjustable (0.9V to 5.0V) Low-Dropout Linear Regulator

## Net classes
0 default: width 0.203 mm, drill 0.33 mm, clearance 0.152 mm